# Altium schematic sheet DockStation.SchDoc
size 840 x 594 mm
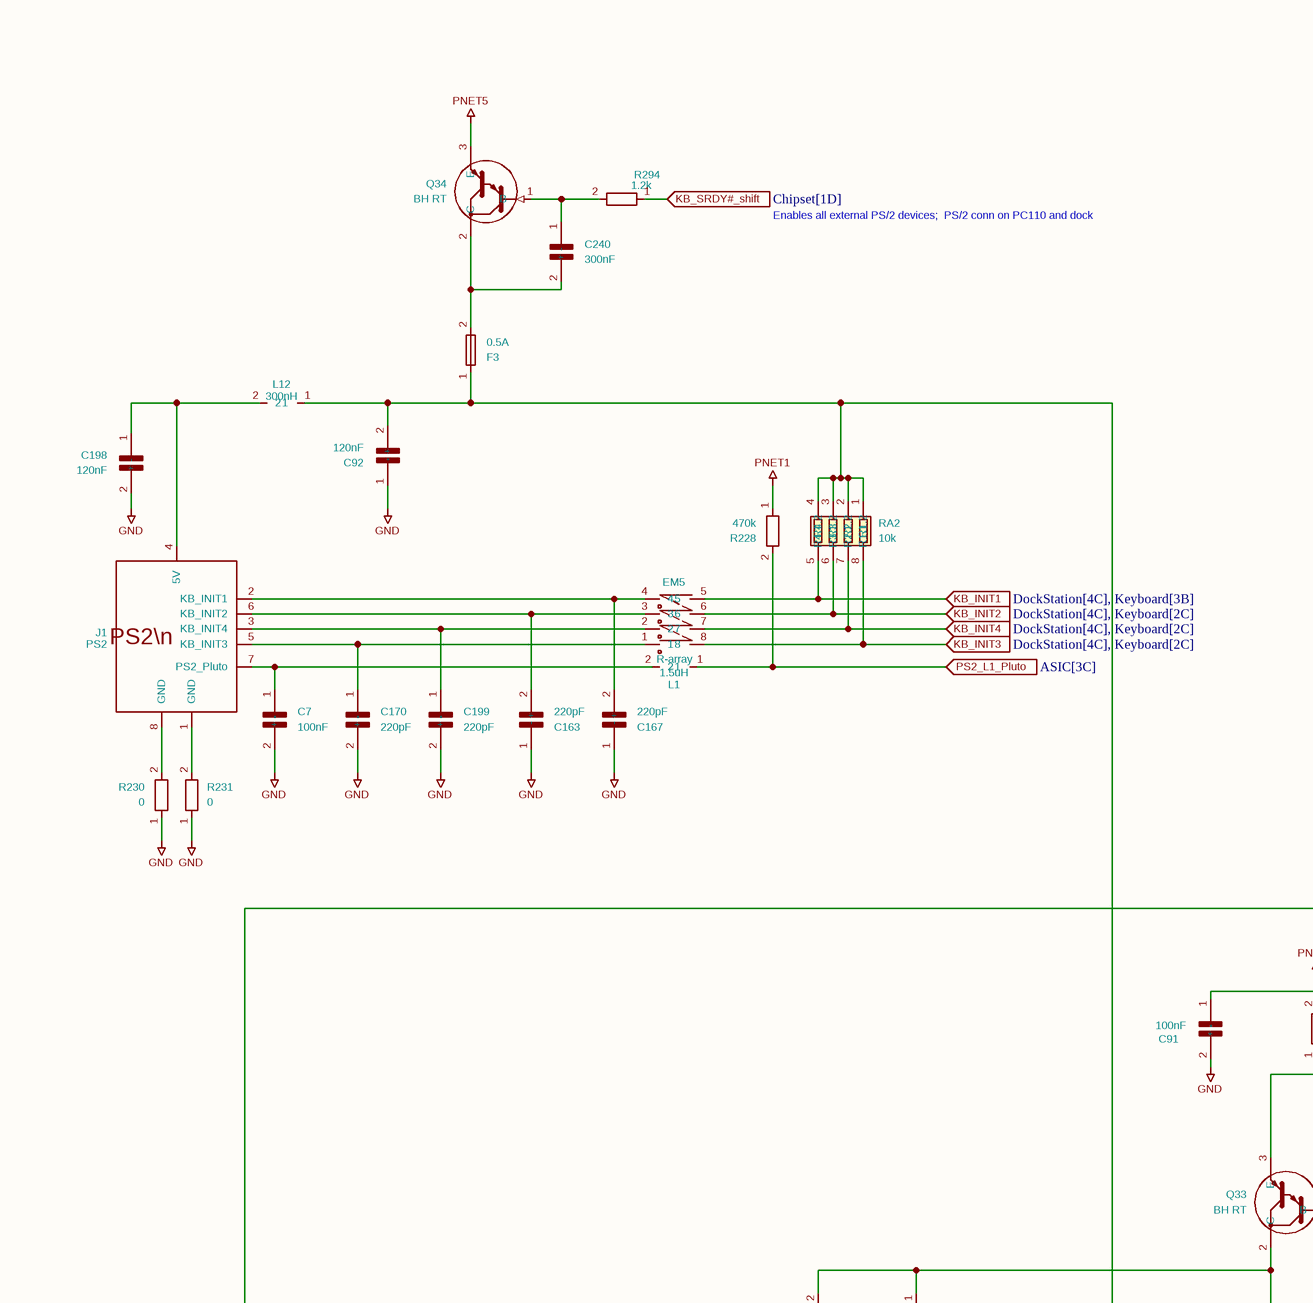
[diagram p0: DockStation.SchDoc, top left]
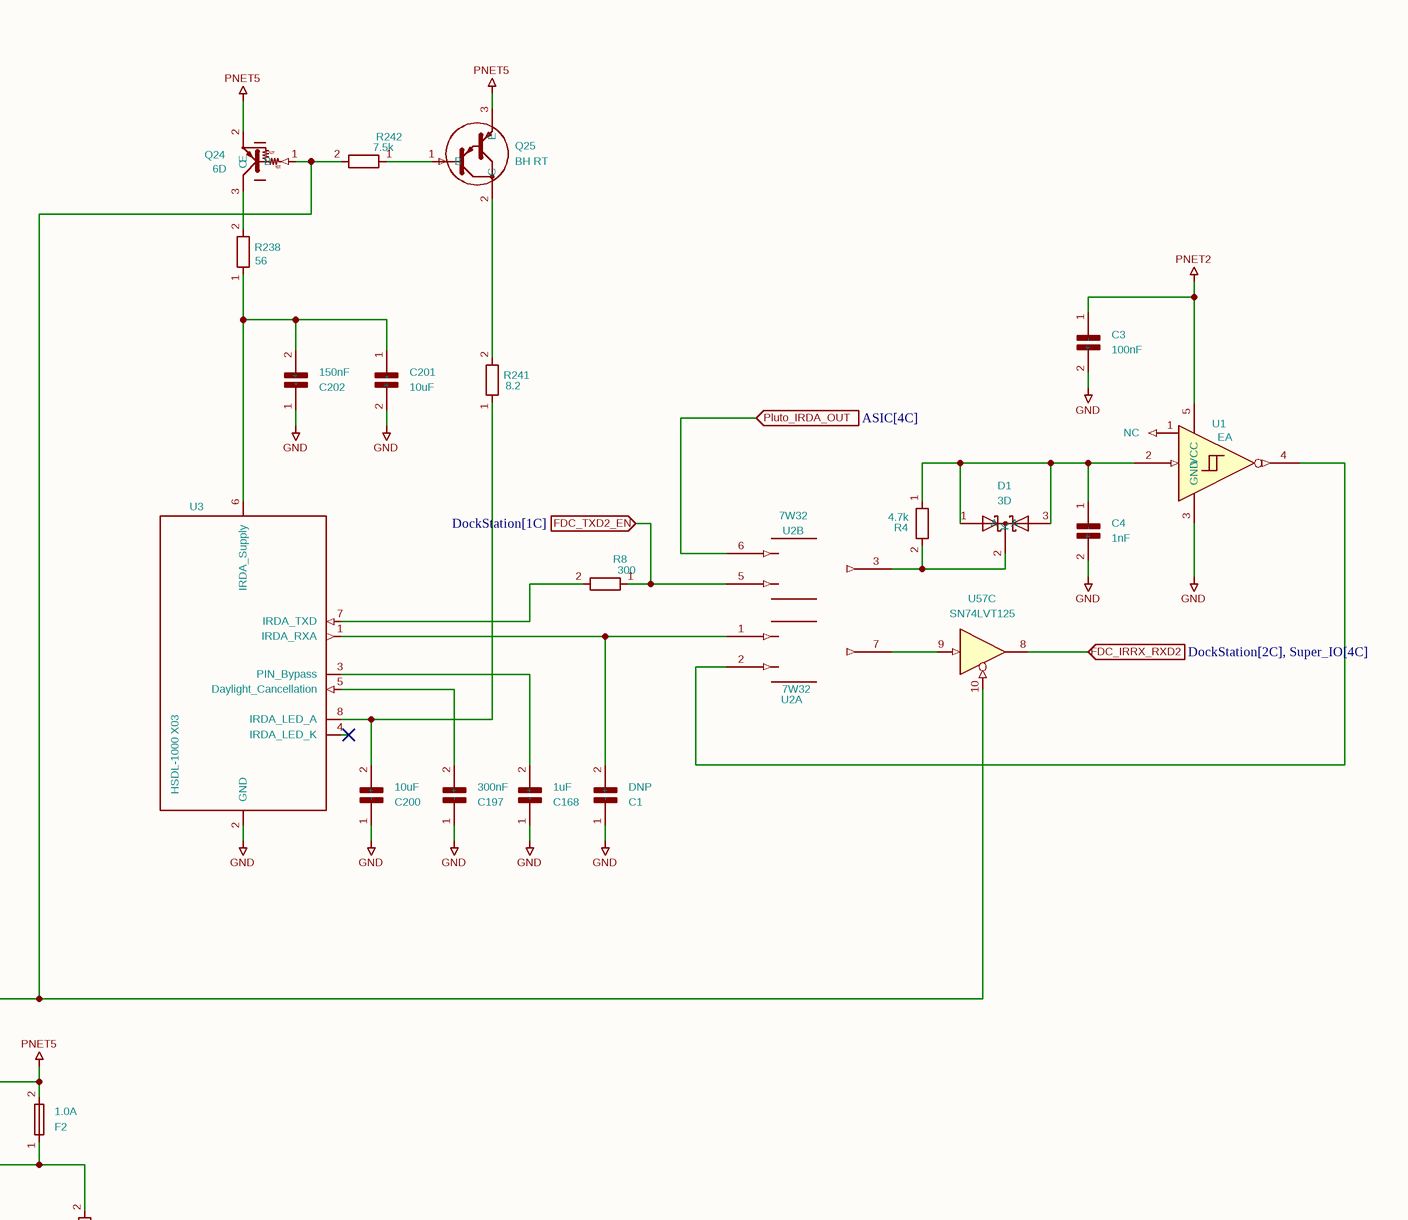
[diagram p1: DockStation.SchDoc, top middle]
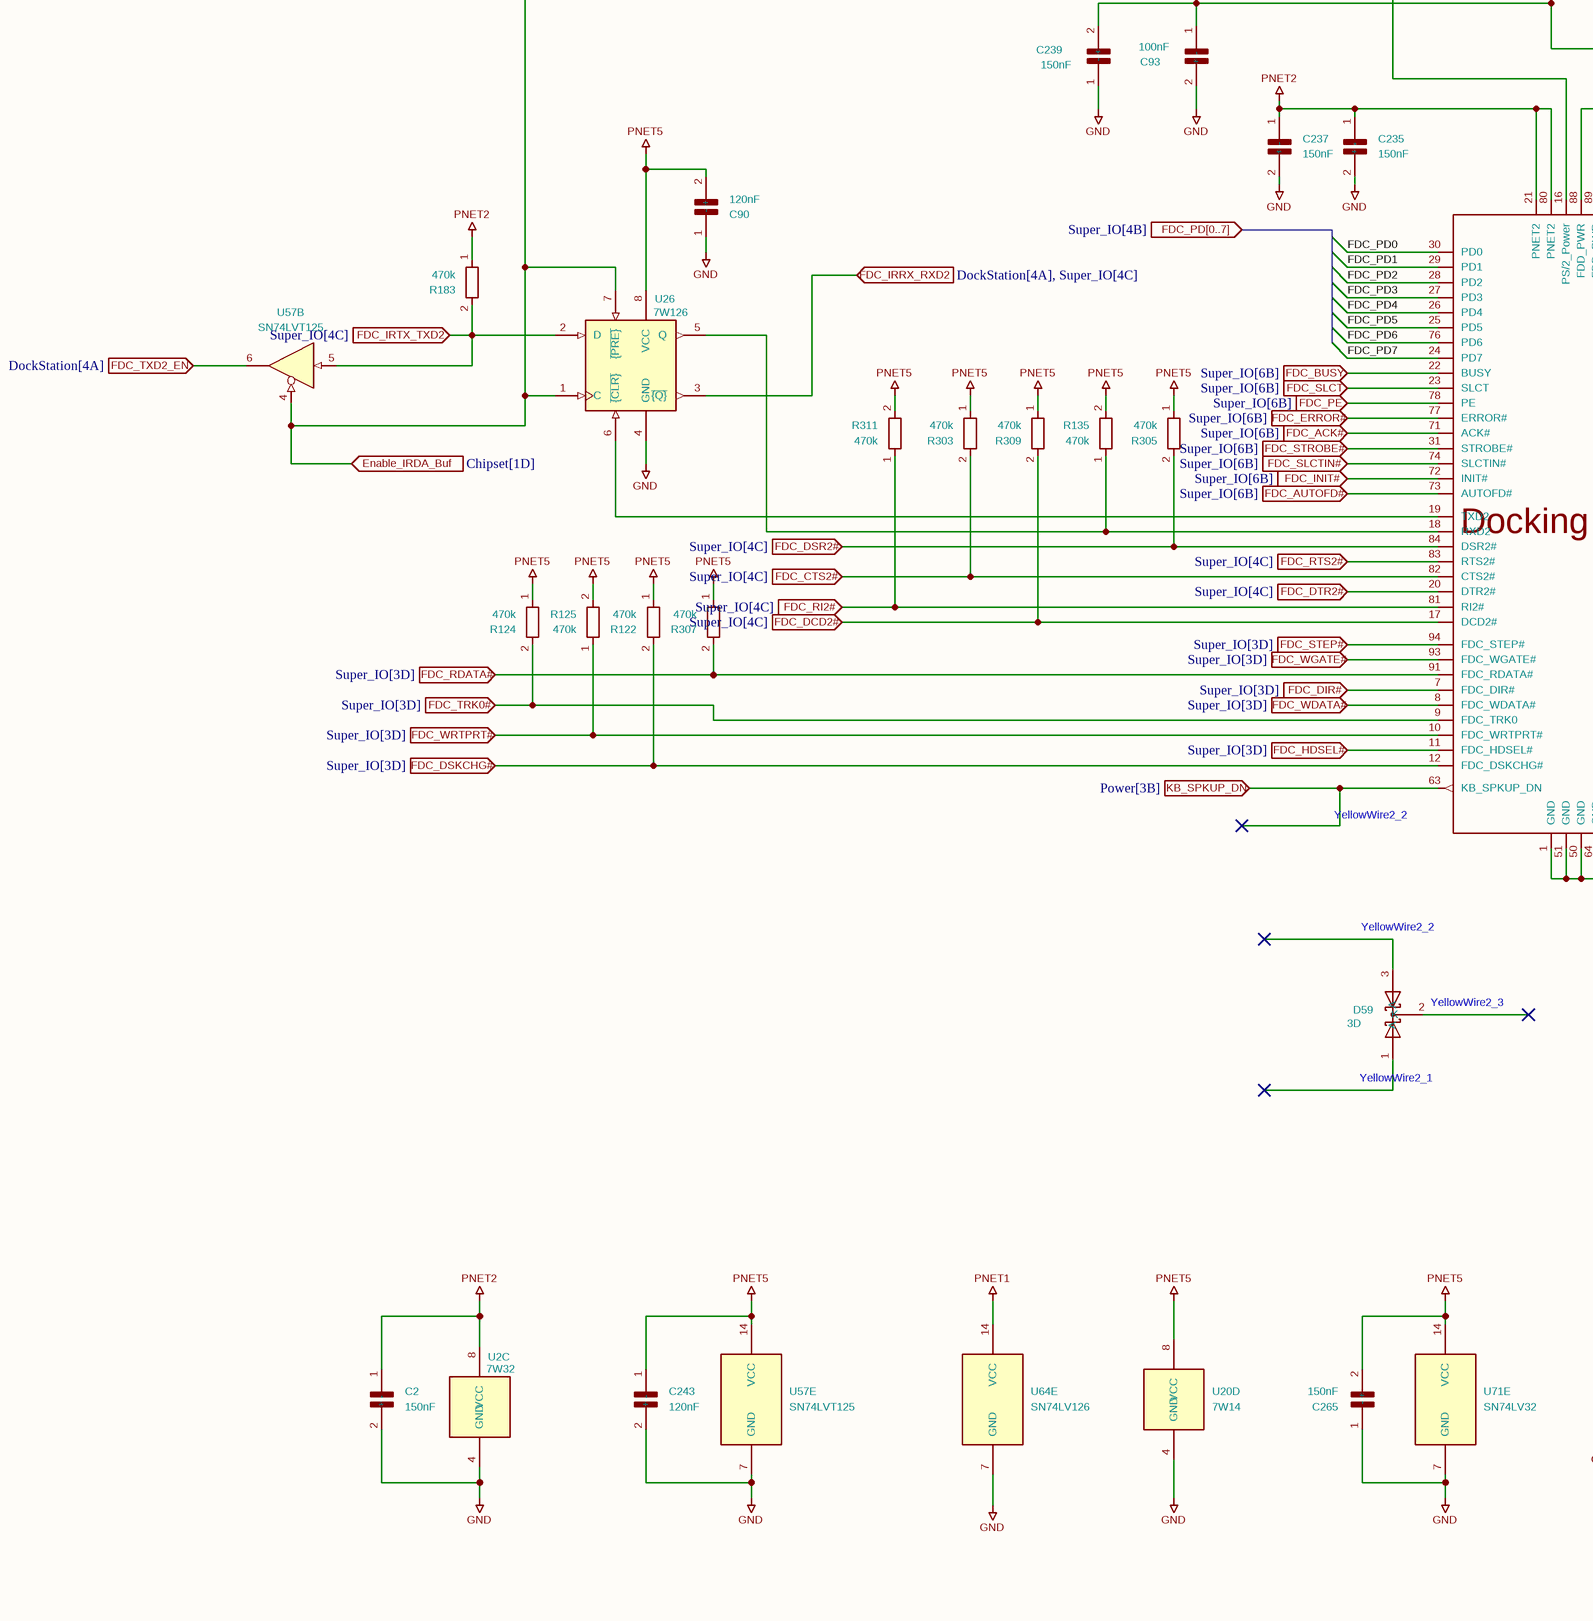
[diagram p2: DockStation.SchDoc, bottom left]
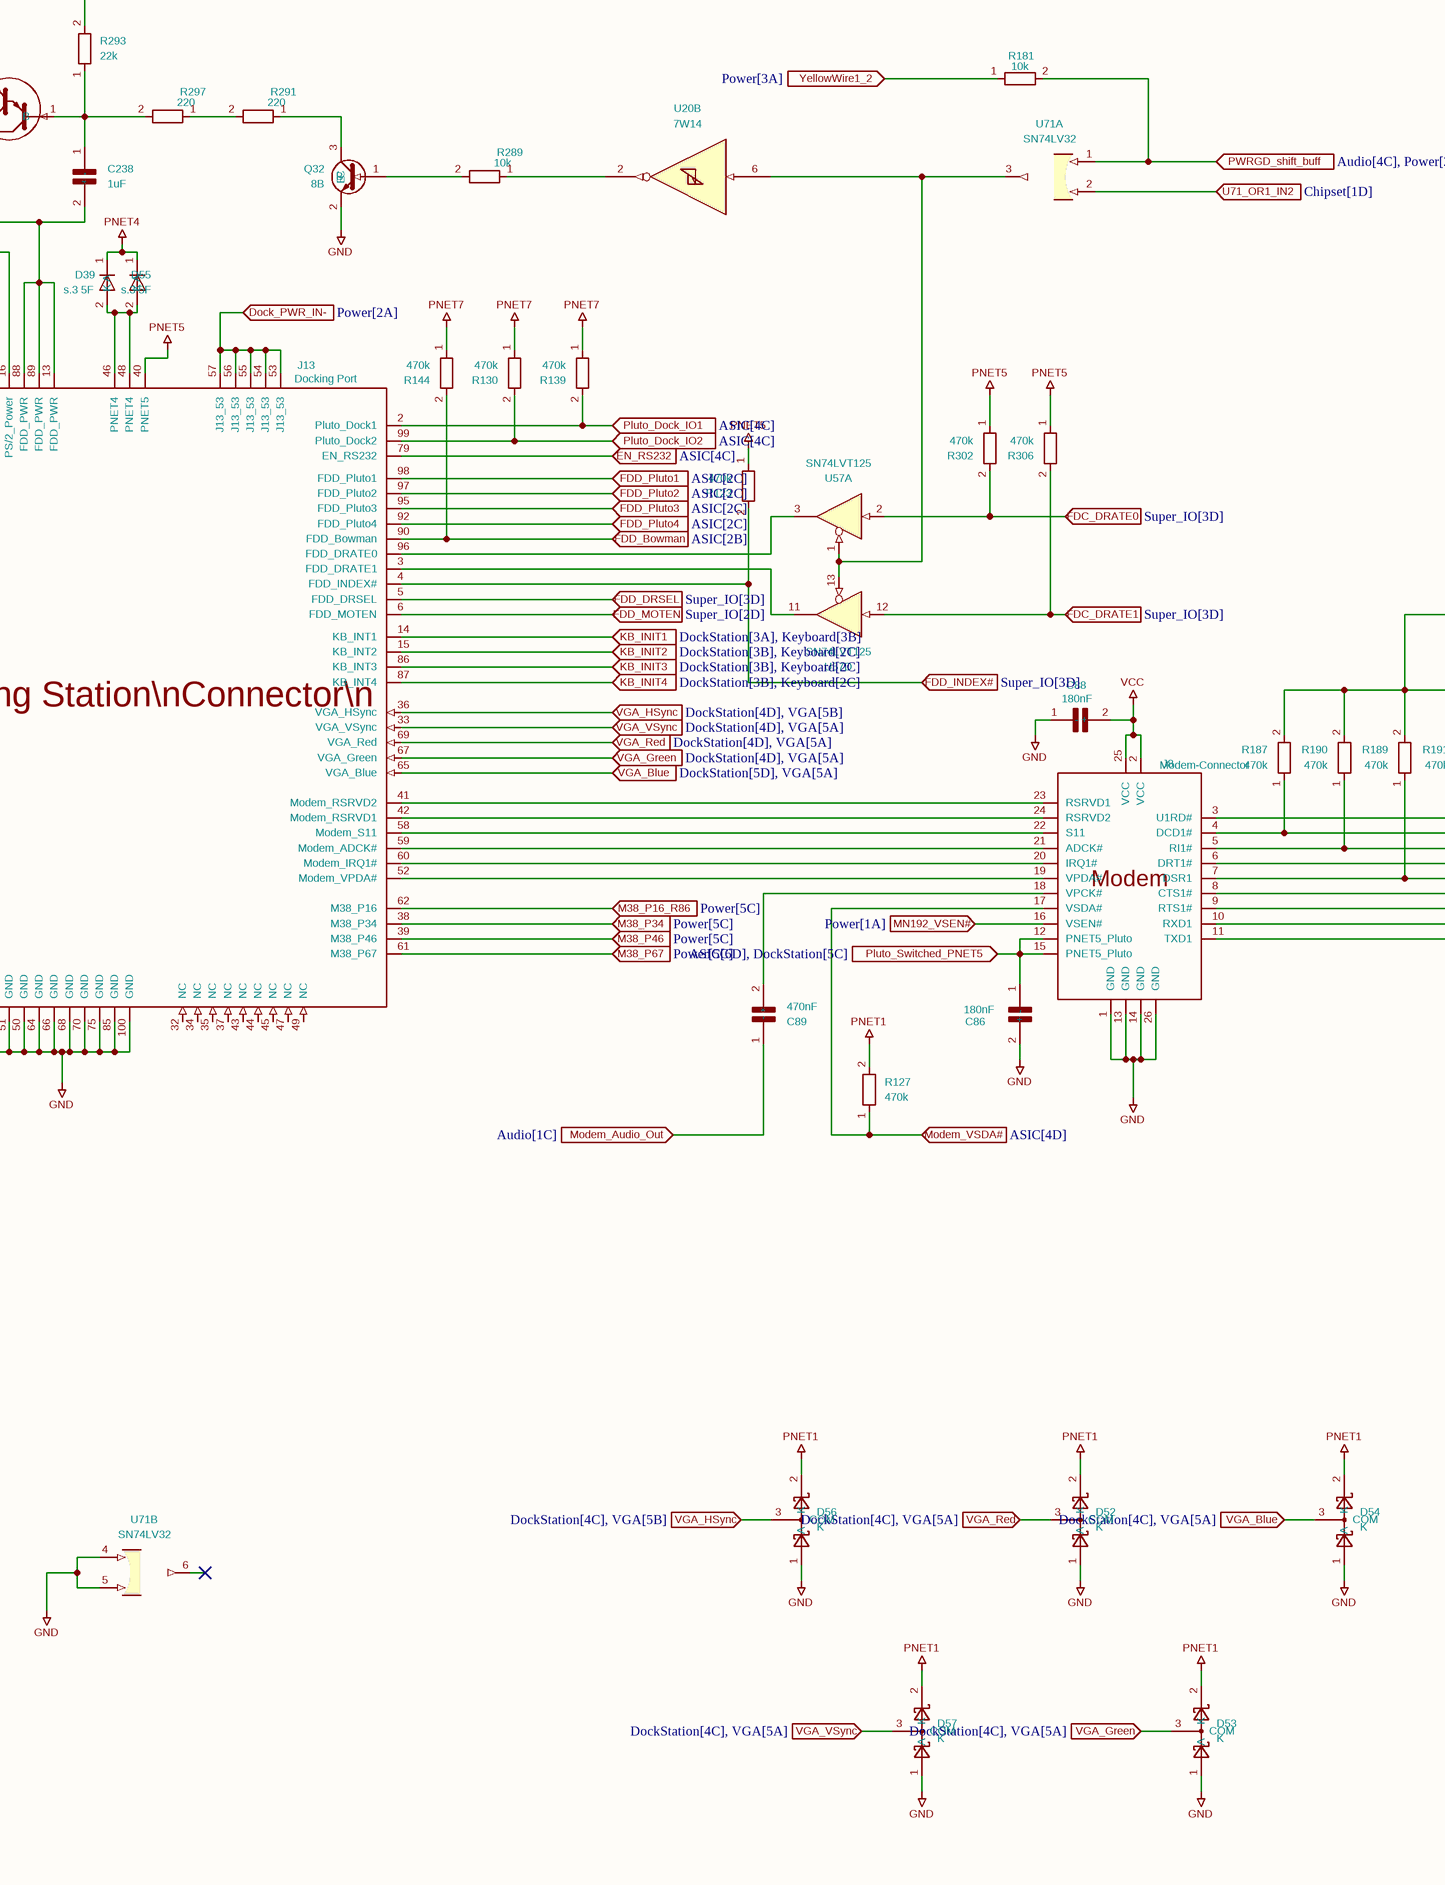
[diagram p3: DockStation.SchDoc, bottom middle]
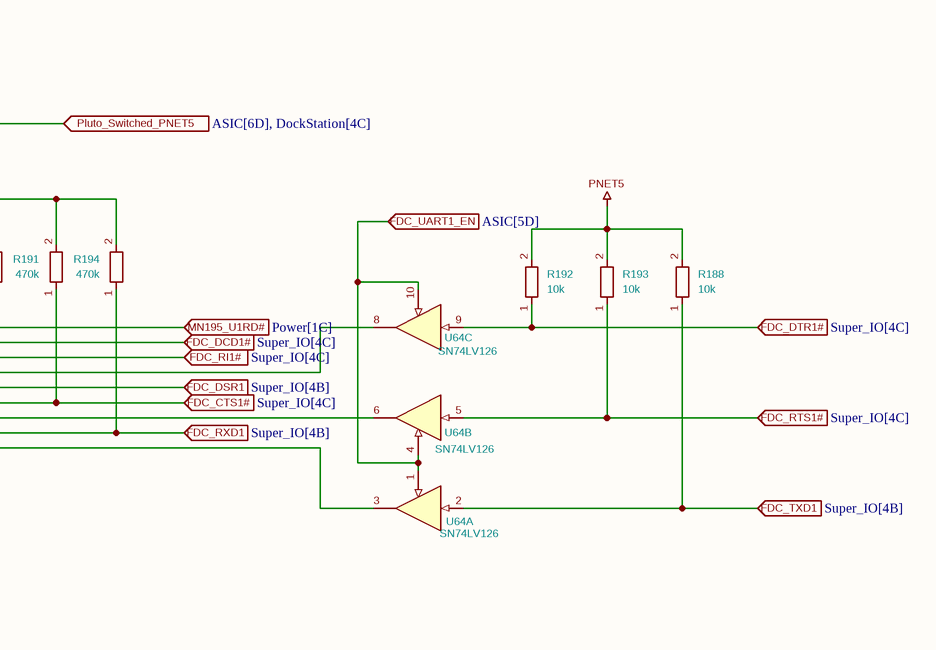
[diagram p4: DockStation.SchDoc, bottom right]

## Parts
C1  DNP  [C_0402_1005Metric]
C2  150nF  [C_0402_1005Metric]
C3  100nF  [C_0402_1005Metric]
C4  1nF  [C_0402_1005Metric]
C7  100nF  [C_0402_1005Metric]
C86  180nF  [C_0402_1005Metric]
C88  180nF  [C_0402_1005Metric]
C89  470nF  [C_0603_1608Metric]
C90  120nF  [C_0402_1005Metric]
C91  100nF  [C_0402_1005Metric]
C92  120nF  [C_0402_1005Metric]
C93  100nF  [C_0402_1005Metric]
C163  220pF  [C_0402_1005Metric]
C167  220pF  [C_0402_1005Metric]
C168  1uF  [C_0603_1608Metric]
C170  220pF  [C_0402_1005Metric]
C197  300nF  [C_0603_1608Metric]
C198  120nF  [C_0402_1005Metric]
C199  220pF  [C_0402_1005Metric]
C200  10uF  [C_1206_3216Metric]
C201  10uF  [C_1206_3216Metric]
C202  150nF  [C_0603_1608Metric]
C235  150nF  [C_0402_1005Metric]
C237  150nF  [C_0402_1005Metric]
C238  1uF  [C_0603_1608Metric]
C239  150nF  [C_0402_1005Metric]
C240  300nF  [C_0603_1608Metric]
C243  120nF  [C_0402_1005Metric]
C265  150nF  [C_0402_1005Metric]
D1  3D  [3D]
D39  s.3 5F  [Diode]
D52  K  [SOT-416]
D53  K  [SOT-416]
D54  K  [SOT-416]
D55  s.3 5F  [Diode]
D56  K  [SOT-416]
D57  K  [SOT-416]
D59  3D  [SOT-416L]
EM5  R-array  [R-array]
F2  1.0A  [Fuse_1206_3216Metric]
F3  0.5A  [Fuse_1206_3216Metric]
J1  PS2  [PS2]
J8  Modem-Connector  [Modem-Connector]
J13  Docking Port  [Docking Port]
L1  1.5uH  [L_0603_1608Metric]
L12  300nH  [L_0805_2012Metric]
Q24  6D  [SOT-23]
Q25  BH RT  [SOT-89-3]
Q32  8B  [SOT-416]
Q33  BH RT  [SOT-89-3]
Q34  BH RT  [SOT-89-3]
R4  4.7k  [R_0402_1005Metric]
R8  300  [R_0402_1005Metric]
R122  470k  [R_0402_1005Metric]
R123  470k  [R_0402_1005Metric]
R124  470k  [R_0402_1005Metric]
R125  470k  [R_0402_1005Metric]
R127  470k  [R_0402_1005Metric]
R130  470k  [R_0402_1005Metric]
R135  470k  [R_0402_1005Metric]
R139  470k  [R_0402_1005Metric]
R144  470k  [R_0402_1005Metric]
R181  10k  [R_0402_1005Metric]
R183  470k  [R_0402_1005Metric]
R187  470k  [R_0402_1005Metric]
R188  10k  [R_0402_1005Metric]
R189  470k  [R_0402_1005Metric]
R190  470k  [R_0402_1005Metric]
R191  470k  [R_0402_1005Metric]
R192  10k  [R_0402_1005Metric]
R193  10k  [R_0402_1005Metric]
R194  470k  [R_0402_1005Metric]
R228  470k  [R_0402_1005Metric]
R230  0  [R_0805_2012Metric]
R231  0  [R_0603_1608Metric]
R238  56  [R_0603_1608Metric]
R241  8.2  [R_1206_3216Metric_Pad1.30x1.75mm_HandSolder]
R242  7.5k  [R_0402_1005Metric]
R289  10k  [R_0402_1005Metric]
R291  220  [R_0402_1005Metric]
R293  22k  [R_0402_1005Metric]
R294  1.2k  [R_0402_1005Metric]
R297  220  [R_0402_1005Metric]
R302  470k  [R_0402_1005Metric]
R303  470k  [R_0402_1005Metric]
R305  470k  [R_0402_1005Metric]
R306  470k  [R_0402_1005Metric]
R307  470k  [R_0402_1005Metric]
R309  470k  [R_0402_1005Metric]
R311  470k  [R_0402_1005Metric]
RA2  10k  [R-array]
U1  EA  [SOT-353]
U2  7W32  [sso-8]  (parts A,B,C of 3)
U3  HSDL-1000 X03  [IRDA]
U20  7W14  [sso-8]  (parts B,D of 4)
U26  7W126  [sso-8]
U57  SN74LVT125  [TSSOP-14_4.4x5mm_P0.65mm]  (parts A,B,C,D,E of 5)
U64  SN74LV126  [TSSOP-14_4.4x5mm_P0.65mm]  (parts A,B,C,E of 5)
U71  SN74LV32  [TSSOP-14_4.4x5mm_P0.65mm]  (parts A,B,E of 5)

## Ports
Dock_PWR_IN- (in, see Power[2A]), EN_RS232 (in, see ASIC[4C]), Enable_IRDA_Buf (in, see Chipset[1D]), FDC_ACK# (in, see Super_IO[6B]), FDC_AUTOFD# (in, see Super_IO[6B]), FDC_BUSY (in, see Super_IO[6B]), FDC_CTS1# (in, see Super_IO[4C]), FDC_CTS2# (in, see Super_IO[4C]), FDC_DCD1# (in, see Super_IO[4C]), FDC_DCD2# (in, see Super_IO[4C]), FDC_DIR# (in, see Super_IO[3D]), FDC_DRATE0 (in, see Super_IO[3D]), FDC_DRATE1 (in, see Super_IO[3D]), FDC_DSKCHG# (in, see Super_IO[3D]), FDC_DSR1 (in, see Super_IO[4B]), FDC_DSR2# (in, see Super_IO[4C]), FDC_DTR1# (in, see Super_IO[4C]), FDC_DTR2# (in, see Super_IO[4C]), FDC_ERROR# (in, see Super_IO[6B]), FDC_HDSEL# (in, see Super_IO[3D]), FDC_INIT# (in, see Super_IO[6B]), FDC_IRRX_RXD2 (in, see DockStation[2C], Super_IO[4C]), FDC_IRRX_RXD2 (in, see DockStation[4A], Super_IO[4C]), FDC_IRTX_TXD2 (in, see Super_IO[4C]), FDC_PD[0..7] (in, see Super_IO[4B]), FDC_PE (in, see Super_IO[6B]), FDC_RDATA# (in, see Super_IO[3D]), FDC_RI1# (in, see Super_IO[4C]), FDC_RI2# (in, see Super_IO[4C]), FDC_RTS1# (in, see Super_IO[4C]), FDC_RTS2# (in, see Super_IO[4C]), FDC_RXD1 (in, see Super_IO[4B]), FDC_SLCT (in, see Super_IO[6B]), FDC_SLCTIN# (in, see Super_IO[6B]), FDC_STEP# (in, see Super_IO[3D]), FDC_STROBE# (in, see Super_IO[6B]), FDC_TRK0# (in, see Super_IO[3D]), FDC_TXD1 (in, see Super_IO[4B]), FDC_TXD2_EN (in, see DockStation[1C]), FDC_TXD2_EN (in, see DockStation[4A]), FDC_UART1_EN (in, see ASIC[5D]), FDC_WDATA# (in, see Super_IO[3D]), FDC_WGATE# (in, see Super_IO[3D]), FDC_WRTPRT# (in, see Super_IO[3D]), FDD_Bowman (in, see ASIC[2B]), FDD_DRSEL (in, see Super_IO[3D]), FDD_INDEX# (in, see Super_IO[3D]), FDD_MOTEN (in, see Super_IO[2D]), FDD_Pluto1 (in, see ASIC[2C]), FDD_Pluto2 (in, see ASIC[2C]), FDD_Pluto3 (in, see ASIC[2C]), FDD_Pluto4 (in, see ASIC[2C]), KB_INIT1 (in, see DockStation[3A], Keyboard[3B]), KB_INIT1 (in, see DockStation[4C], Keyboard[3B]), KB_INIT2 (in, see DockStation[3B], Keyboard[2C]), KB_INIT2 (in, see DockStation[4C], Keyboard[2C]), KB_INIT3 (in, see DockStation[3B], Keyboard[2C]), KB_INIT3 (in, see DockStation[4C], Keyboard[2C]), KB_INIT4 (in, see DockStation[3B], Keyboard[2C]), KB_INIT4 (in, see DockStation[4C], Keyboard[2C]), KB_SPKUP_DN (in, see Power[3B]), KB_SRDY#_shift (in, see Chipset[1D]), M38_P16_R86 (in, see Power[5C]), M38_P34 (in, see Power[5C]), M38_P46 (in, see Power[5C]), M38_P67 (in, see Power[5C]), MN192_VSEN# (in, see Power[1A]), MN195_U1RD# (in, see Power[1C]), Modem_Audio_Out (in, see Audio[1C]), Modem_VSDA# (in, see ASIC[4D]), Pluto_Dock_IO1 (in, see ASIC[4C]), Pluto_Dock_IO2 (in, see ASIC[4C]), Pluto_IRDA_OUT (in, see ASIC[4C]), Pluto_Switched_PNET5 (in, see ASIC[6D], DockStation[4C]), Pluto_Switched_PNET5 (in, see ASIC[6D], DockStation[5C]), PS2_L1_Pluto (in, see ASIC[3C]), PWRGD_shift_buff (in, see Audio[4C], Power[2C], Power[5C], ROM[6B]), U71_OR1_IN2 (in, see Chipset[1D]), VGA_Blue (in, see DockStation[4C], VGA[5A]), VGA_Blue (in, see DockStation[5D], VGA[5A]), VGA_Green (in, see DockStation[4C], VGA[5A]), VGA_Green (in, see DockStation[4D], VGA[5A]), VGA_HSync (in, see DockStation[4C], VGA[5B]), VGA_HSync (in, see DockStation[4D], VGA[5B]), VGA_Red (in, see DockStation[4C], VGA[5A]), VGA_Red (in, see DockStation[4D], VGA[5A]), VGA_VSync (in, see DockStation[4C], VGA[5A]), VGA_VSync (in, see DockStation[4D], VGA[5A]), YellowWire1_2 (in, see Power[3A])

## Nets
GND: C1.1(+) C2.2(-) C3.2(-) C4.2(-) C7.2(-) C86.2(-) C88.1(+) C90.1(+) C91.2(-) C92.1(+) C93.2(-) C163.1(+) C167.1(+) C168.1(+) C170.2(-) C197.1(+) C198.2(-) C199.2(-) C200.1(+) C201.2(-) C202.1(+) C235.2(-) C237.2(-) C239.1(+) C243.2(-) C265.1(+) D52.1(A) D53.1(A) D54.1(A) D56.1(A) D57.1(A) J8.1(GND) J8.13(GND) J8.14(GND) J8.26(GND) J13.1(GND) J13.50(GND) J13.51(GND) J13.64(GND) J13.66(GND) J13.68(GND) J13.70(GND) J13.75(GND) J13.85(GND) J13.100(GND) Q32.2(E) R230.1 R231.1 U1.3(GND) U2.4(GND) U3.2(GND) U20.4(GND) U26.4(GND) U57.7(GND) U64.7(GND) U71.4 U71.5 U71.7(GND)
PNET1: D52.2(K) D53.2(K) D54.2(K) D56.2(K) D57.2(K) R127.2 R228.1 U64.14(VCC)
PNET2: C2.1(+) C3.1(+) C235.1(+) C237.1(+) J13.21(PNET2) J13.80(PNET2) R183.1 U1.5(VCC) U2.8(VCC)
PNET4: D39.1(K) D55.1(K)
PNET5: C90.2(-) C91.1(+) C243.1(+) C265.2(-) F2.2 J13.40(PNET5) Q24.2(E) Q25.3(E) Q34.3(E) R122.1 R123.1 R124.1 R125.2 R135.2 R188.2 R192.2 R193.2 R302.1 R303.1 R305.1 R306.1 R307.1 R309.1 R311.2 U20.8(VCC) U26.8(VCC) U57.14(VCC) U71.14(VCC)
PNET7: R130.1 R139.1 R144.1
VCC: C88.2(-) J8.2(VCC) J8.25(VCC)
Dock_PWR_IN-: J13.53(J13_53) J13.54(J13_53) J13.55(J13_53) J13.56(J13_53) J13.57(J13_53) ; port Dock_PWR_IN-
EN_RS232: J13.79(EN_RS232) ; port EN_RS232
Enable_IRDA_Buf: Q24.1(B) R242.2 U26.1(C) U26.7(~{{PRE}}) U57.4 U57.10 ; port Enable_IRDA_Buf
FDC_ACK#: J13.71(ACK#) ; port FDC_ACK#
FDC_AUTOFD#: J13.73(AUTOFD#) ; port FDC_AUTOFD#
FDC_BUSY: J13.22(BUSY) ; port FDC_BUSY
FDC_CTS1#: J8.8(CTS1#) R191.1 ; port FDC_CTS1#
FDC_CTS2#: J13.82(CTS2#) R303.2 ; port FDC_CTS2#
FDC_DCD1#: J8.4(DCD1#) R187.1 ; port FDC_DCD1#
FDC_DCD2#: J13.17(DCD2#) R309.2 ; port FDC_DCD2#
FDC_DIR#: J13.7(FDC_DIR#) ; port FDC_DIR#
FDC_DRATE0: R302.2 U57.2 ; port FDC_DRATE0
FDC_DRATE1: R306.2 U57.12 ; port FDC_DRATE1
FDC_DSKCHG#: J13.12(FDC_DSKCHG#) R122.2 ; port FDC_DSKCHG#
FDC_DSR1: J8.7(DSR1) R189.1 ; port FDC_DSR1
FDC_DSR2#: J13.84(DSR2#) R305.2 ; port FDC_DSR2#
FDC_DTR1#: R192.1 U64.9 ; port FDC_DTR1#
FDC_DTR2#: J13.20(DTR2#) ; port FDC_DTR2#
FDC_ERROR#: J13.77(ERROR#) ; port FDC_ERROR#
FDC_HDSEL#: J13.11(FDC_HDSEL#) ; port FDC_HDSEL#
FDC_INIT#: J13.72(INIT#) ; port FDC_INIT#
FDC_IRRX_RXD2: U26.3(~{{Q}}) U57.8 ; port FDC_IRRX_RXD2
FDC_IRTX_TXD2: R183.2 U26.2(D) U57.5 ; port FDC_IRTX_TXD2
FDC_PD0: J13.30(PD0)
FDC_PD1: J13.29(PD1)
FDC_PD2: J13.28(PD2)
FDC_PD3: J13.27(PD3)
FDC_PD4: J13.26(PD4)
FDC_PD5: J13.25(PD5)
FDC_PD6: J13.76(PD6)
FDC_PD7: J13.24(PD7)
FDC_PE: J13.78(PE) ; port FDC_PE
FDC_RDATA#: J13.91(FDC_RDATA#) R307.2 ; port FDC_RDATA#
FDC_RI1#: J8.5(RI1#) R190.1 ; port FDC_RI1#
FDC_RI2#: J13.81(RI2#) R311.1 ; port FDC_RI2#
FDC_RTS1#: R193.1 U64.5 ; port FDC_RTS1#
FDC_RTS2#: J13.83(RTS2#) ; port FDC_RTS2#
FDC_RXD1: J8.10(RXD1) R194.1 ; port FDC_RXD1
FDC_SLCT: J13.23(SLCT) ; port FDC_SLCT
FDC_SLCTIN#: J13.74(SLCTIN#) ; port FDC_SLCTIN#
FDC_STEP#: J13.94(FDC_STEP#) ; port FDC_STEP#
FDC_STROBE#: J13.31(STROBE#) ; port FDC_STROBE#
FDC_TRK0#: J13.9(FDC_TRK0) R124.2 ; port FDC_TRK0#
FDC_TXD1: R188.1 U64.2 ; port FDC_TXD1
FDC_TXD2_EN: R8.1 U2.5 U57.6 ; port FDC_TXD2_EN
FDC_UART1_EN: U64.1 U64.4 U64.10 ; port FDC_UART1_EN
FDC_WDATA#: J13.8(FDC_WDATA#) ; port FDC_WDATA#
FDC_WGATE#: J13.93(FDC_WGATE#) ; port FDC_WGATE#
FDC_WRTPRT#: J13.10(FDC_WRTPRT#) R125.1 ; port FDC_WRTPRT#
FDD_Bowman: J13.90(FDD_Bowman) R144.2 ; port FDD_Bowman
FDD_DRSEL: J13.5(FDD_DRSEL) ; port FDD_DRSEL
FDD_INDEX#: J13.4(FDD_INDEX#) R123.2 ; port FDD_INDEX#
FDD_MOTEN: J13.6(FDD_MOTEN) ; port FDD_MOTEN
FDD_Pluto1: J13.98(FDD_Pluto1) ; port FDD_Pluto1
FDD_Pluto2: J13.97(FDD_Pluto2) ; port FDD_Pluto2
FDD_Pluto3: J13.95(FDD_Pluto3) ; port FDD_Pluto3
FDD_Pluto4: J13.92(FDD_Pluto4) ; port FDD_Pluto4
KB_INIT1: EM5.5 J13.14(KB_INT1) RA2.5(R4.2) ; port KB_INIT1
KB_INIT2: EM5.6 J13.15(KB_INT2) RA2.6(R3.2) ; port KB_INIT2
KB_INIT3: EM5.8 J13.86(KB_INT3) RA2.8(R1.2) ; port KB_INIT3
KB_INIT4: EM5.7 J13.87(KB_INT4) RA2.7(R2.2) ; port KB_INIT4
KB_SPKUP_DN: J13.63(KB_SPKUP_DN) ; port KB_SPKUP_DN
KB_SRDY#_shift: R294.1 ; port KB_SRDY#_shift
M38_P16_R86: J13.62(M38_P16) ; port M38_P16_R86
M38_P34: J13.38(M38_P34) ; port M38_P34
M38_P46: J13.39(M38_P46) ; port M38_P46
M38_P67: J13.61(M38_P67) ; port M38_P67
MN192_VSEN#: J8.16(VSEN#) ; port MN192_VSEN#
MN195_U1RD#: J8.3(U1RD#) ; port MN195_U1RD#
Modem_Audio_Out: C89.1(+) ; port Modem_Audio_Out
Modem_VSDA#: J8.17(VSDA#) R127.1 ; port Modem_VSDA#
Pluto_Dock_IO1: J13.2(Pluto_Dock1) R139.2 ; port Pluto_Dock_IO1
Pluto_Dock_IO2: J13.99(Pluto_Dock2) R130.2 ; port Pluto_Dock_IO2
Pluto_IRDA_OUT: U2.6 ; port Pluto_IRDA_OUT
Pluto_Switched_PNET5: C86.1(+) J8.12(PNET5_Pluto) J8.15(PNET5_Pluto) R187.2 R189.2 R190.2 R191.2 R194.2 ; port Pluto_Switched_PNET5
PS2_L1_Pluto: L1.1 R228.2 ; port PS2_L1_Pluto
PWRGD_shift_buff: R181.2 U71.1 ; port PWRGD_shift_buff
U71_OR1_IN2: U71.2 ; port U71_OR1_IN2
VGA_Blue: D54.3(COM) J13.65(VGA_Blue) ; port VGA_Blue
VGA_Green: D53.3(COM) J13.67(VGA_Green) ; port VGA_Green
VGA_HSync: D56.3(COM) J13.36(VGA_HSync) ; port VGA_HSync
VGA_Red: D52.3(COM) J13.69(VGA_Red) ; port VGA_Red
VGA_VSync: D57.3(COM) J13.33(VGA_VSync) ; port VGA_VSync
YellowWire1_2: R181.1 ; port YellowWire1_2
NetC1_2: C1.2(-) U2.1 U3.1(IRDA_RXA)
NetC4_1: C4.1(+) D1.1(A) D1.3(A) R4.1 U1.2
NetC7_1: C7.1(+) J1.7(PS2_Pluto) L1.2
NetC89_2: C89.2(-) J8.18(VPCK#)
NetC92_2: C92.2(-) F3.1 J13.16(PS/2_Power) L12.1 RA2.1(R1.1) RA2.2(R2.1) RA2.3(R3.1) RA2.4(R4.1)
NetC93_1: C93.1(+) C238.2(-) C239.2(-) J13.13(FDD_PWR) J13.88(FDD_PWR) J13.89(FDD_PWR) Q33.2(C)
NetC163_2: C163.2(-) EM5.3 J1.6(KB_INIT2)
NetC167_2: C167.2(-) EM5.4 J1.2(KB_INIT1)
NetC168_2: C168.2(-) U3.3(PIN_Bypass)
NetC170_1: C170.1(+) EM5.1 J1.5(KB_INIT3)
NetC197_2: C197.2(-) U3.5(Daylight_Cancellation)
NetC198_1: C198.1(+) J1.4(5V) L12.2
NetC199_1: C199.1(+) EM5.2 J1.3(KB_INIT4)
NetC200_2: C200.2(-) R241.1 U3.8(IRDA_LED_A)
NetC201_1: C201.1(+) C202.2(-) R238.1 U3.6(IRDA_Supply)
NetC238_1: C238.1(+) Q33.1(B) R293.1 R297.2
NetC240_1: C240.1(+) Q34.1(B) R294.2
NetC240_2: C240.2(-) F3.2 Q34.2(C)
NetD1_2: D1.2(K) R4.2 U2.3
NetD39_2: D39.2(A) D55.2(A) J13.46(PNET4) J13.48(PNET4)
NetF2_1: F2.1 Q33.3(E) R293.2
NetJ1_1: J1.1(GND) R231.2
NetJ1_8: J1.8(GND) R230.2
NetJ8_6: J8.6(DRT1#) U64.8
NetJ8_9: J8.9(RTS1#) U64.6
NetJ8_11: J8.11(TXD1) U64.3
NetJ8_19: J8.19(VPDA#) J13.52(Modem_VPDA#)
NetJ8_20: J8.20(IRQ1#) J13.60(Modem_IRQ1#)
NetJ8_21: J8.21(ADCK#) J13.59(Modem_ADCK#)
NetJ8_22: J8.22(S11) J13.58(Modem_S11)
NetJ8_23: J8.23(RSRVD1) J13.41(Modem_RSRVD2)
NetJ8_24: J8.24(RSRVD2) J13.42(Modem_RSRVD1)
NetJ13_3: J13.3(FDD_DRATE1) U57.11
NetJ13_18: J13.18(RXD2) R135.1 U26.5(Q)
NetJ13_19: J13.19(TXD2) U26.6(~{{CLR}})
NetJ13_96: J13.96(FDD_DRATE0) U57.3
NetQ24_3: Q24.3(C) R238.2
NetQ25_1: Q25.1(B) R242.1
NetQ25_2: Q25.2(C) R241.2
NetQ32_1: Q32.1(B) R289.2
NetQ32_3: Q32.3(C) R291.1
NetR8_2: R8.2 U3.7(IRDA_TXD)
NetR289_1: R289.1 U20.2
NetR291_2: R291.2 R297.1
NetU1_4: U1.4 U2.2
NetU2_7: U2.7 U57.9
NetU20_6: U20.6 U57.1 U57.13 U71.3

Not connected (* = marked no-connect by the designer): D59 1(A)* 2(K)* 3(A)*; J13 32(NC) 34(NC) 35(NC) 37(NC) 43(NC) 44(NC) 45(NC) 47(NC) 49(NC); U1 1(NC); U3 4(IRDA_LED_K)*; U71 6*

## Notes on the sheet
- Enables all external PS/2 devices;
  PS/2 conn on PC110 and dock
- (near J13) YellowWire2_2
- (near D59) YellowWire2_2
- (near D59) YellowWire2_3
- (near D59) YellowWire2_1
- 1
- 2
- 3
- 4
- 5
- 6
- 7
- 8
- 9
- 10
- 11
- 12
- 13
- 14
- 15
- 16
- A
- B
- C
- D
- E
- F
- G
- H
- I
- J
- K
- Title: PC110
- File: DockStation.kicad_sch
- Sheet: /
- Recreated by: Ahmad Byagowi
- KiCad E.D.A.  kicad (5.1.4)-1
- Size: A1
- Date:
- Rev:
- Id: 1/1
- (in symbol Dock_Conn) Docking Station\nConnector\n
- (in symbol DTA114Y) 47k; 10k
- (in symbol Modem_Conn) Modem
- (in symbol PS2_Conn) PS2\n

## Library data of the parts
C1-C4 C7 C86 C88-C93 C163 C167 C168 C170 C197-C202 C235 C237-C240 C243 C265 = C
  C1: Value: DNP; Footprint: Capacitor_SMD:C_0402_1005Metric
  C2 C235 C237 C239 C265: Value: 150nF; Footprint: Capacitor_SMD:C_0402_1005Metric
  C3 C7 C91 C93: Value: 100nF; Footprint: Capacitor_SMD:C_0402_1005Metric
  C4: Value: 1nF; Footprint: Capacitor_SMD:C_0402_1005Metric
  C86 C88: Value: 180nF; Footprint: Capacitor_SMD:C_0402_1005Metric
  C89: Value: 470nF; Footprint: Capacitor_SMD:C_0603_1608Metric
  C90 C92 C198 C243: Value: 120nF; Footprint: Capacitor_SMD:C_0402_1005Metric
  C163 C167 C170 C199: Value: 220pF; Footprint: Capacitor_SMD:C_0402_1005Metric
  C168 C238: Value: 1uF; Footprint: Capacitor_SMD:C_0603_1608Metric
  C197 C240: Value: 300nF; Footprint: Capacitor_SMD:C_0603_1608Metric
  C200 C201: Value: 10uF; Footprint: Capacitor_SMD:C_1206_3216Metric
  C202: Value: 150nF; Footprint: Capacitor_SMD:C_0603_1608Metric
D1 D59 = D_Schottky_Dual_CommonCathode_AKA: Value: 3D
  D1: Footprint: PC110:3D
  D59: Footprint: PC110:SOT-416L
D39 D55 = D: Value: s.3 5F; Footprint: PC110:Diode
D52-D54 D56 D57 = BAT54SW: Value: K; Footprint: Package_TO_SOT_SMD:SOT-416
EM5 = EMI_filter_Array: Value: R-array; Footprint: PC110:R-array
F2 F3 = Fuse: Footprint: Fuse:Fuse_1206_3216Metric
  F2: Value: 1.0A
  F3: Value: 0.5A
J1 = PS2_Conn: Value: PS2; Footprint: PC110:PS2
J8 = Modem_Conn: Value: Modem-Connector; Footprint: PC110:Modem-Connector
J13 = Dock_Conn: Value: Docking Port; Footprint: PC110:Docking Port
L1 L12 = L
  L1: Value: 1.5uH; Footprint: Inductor_SMD:L_0603_1608Metric
  L12: Value: 300nH; Footprint: Inductor_SMD:L_0805_2012Metric
Q24 = DTA114Y: Value: 6D; Footprint: PCM_Package_TO_SOT_SMD_AKL:SOT-23
Q25 Q33 Q34 = Q_PNP_Darlington_Generic_BCE: Value: BH RT; Footprint: Package_TO_SOT_SMD:SOT-89-3
Q32 = Q_NPN_Generic_BEC: Value: 8B; Footprint: Package_TO_SOT_SMD:SOT-416
R4 R8 R122-R125 R127 R130 R135 R139 R144 R181 R183 R187-R194 R228 R230 R231 R238 R241 R242 R289 R291 R293 R294 R297 R302 R303 R305-R307 R309 R311 = R
  R4: Value: 4.7k; Footprint: PCM_Resistor_SMD_AKL:R_0402_1005Metric
  R8: Value: 300; Footprint: PCM_Resistor_SMD_AKL:R_0402_1005Metric
  R122-R125 R127 R130 R135 R139 R144 R183 R187 R189-R191 R194 R228: Value: 470k; Footprint: PCM_Resistor_SMD_AKL:R_0402_1005Metric
  R181 R188 R192 R193: Value: 10k; Footprint: PCM_Resistor_SMD_AKL:R_0402_1005Metric
  R230: Value: 0; Footprint: PCM_Resistor_SMD_AKL:R_0805_2012Metric
  R231: Value: 0; Footprint: PCM_Resistor_SMD_AKL:R_0603_1608Metric
  R238: Value: 56; Footprint: Resistor_SMD:R_0603_1608Metric
  R241: Value: 8.2; Footprint: Resistor_SMD:R_1206_3216Metric_Pad1.30x1.75mm_HandSolder
  R242: Value: 7.5k; Footprint: PCM_Resistor_SMD_AKL:R_0402_1005Metric
  R289: Value: 10k; Footprint: Resistor_SMD:R_0402_1005Metric
  R291 R297: Value: 220; Footprint: Resistor_SMD:R_0402_1005Metric
  R293: Value: 22k; Footprint: Resistor_SMD:R_0402_1005Metric
  R294: Value: 1.2k; Footprint: Resistor_SMD:R_0402_1005Metric
  R302 R303 R305-R307 R309 R311: Value: 470k; Footprint: Resistor_SMD:R_0402_1005Metric
RA2 = R_Pack04: Value: 10k; Footprint: PC110:R-array
U1 = 74AHC1G14: Value: EA; Footprint: PC110:SOT-353
U2 = 74LVC2G32: Value: 7W32; Footprint: PC110:sso-8
U3 = IRDA: Value: HSDL-1000 X03; Footprint: PC110:IRDA
U20 = 74LVC3G14: Value: 7W14; Footprint: PC110:sso-8
U26 = 74AUC1G74: Value: 7W126; Footprint: PC110:sso-8
U57 = 74LS125: Value: SN74LVT125; Footprint: Package_SO:TSSOP-14_4.4x5mm_P0.65mm
U64 = 74LS126: Value: SN74LV126; Footprint: Package_SO:TSSOP-14_4.4x5mm_P0.65mm
U71 = 74LS32: Value: SN74LV32; Footprint: Package_SO:TSSOP-14_4.4x5mm_P0.65mm